# EAGLE design Dashboard rev3 (EAGLE 9.6.2)
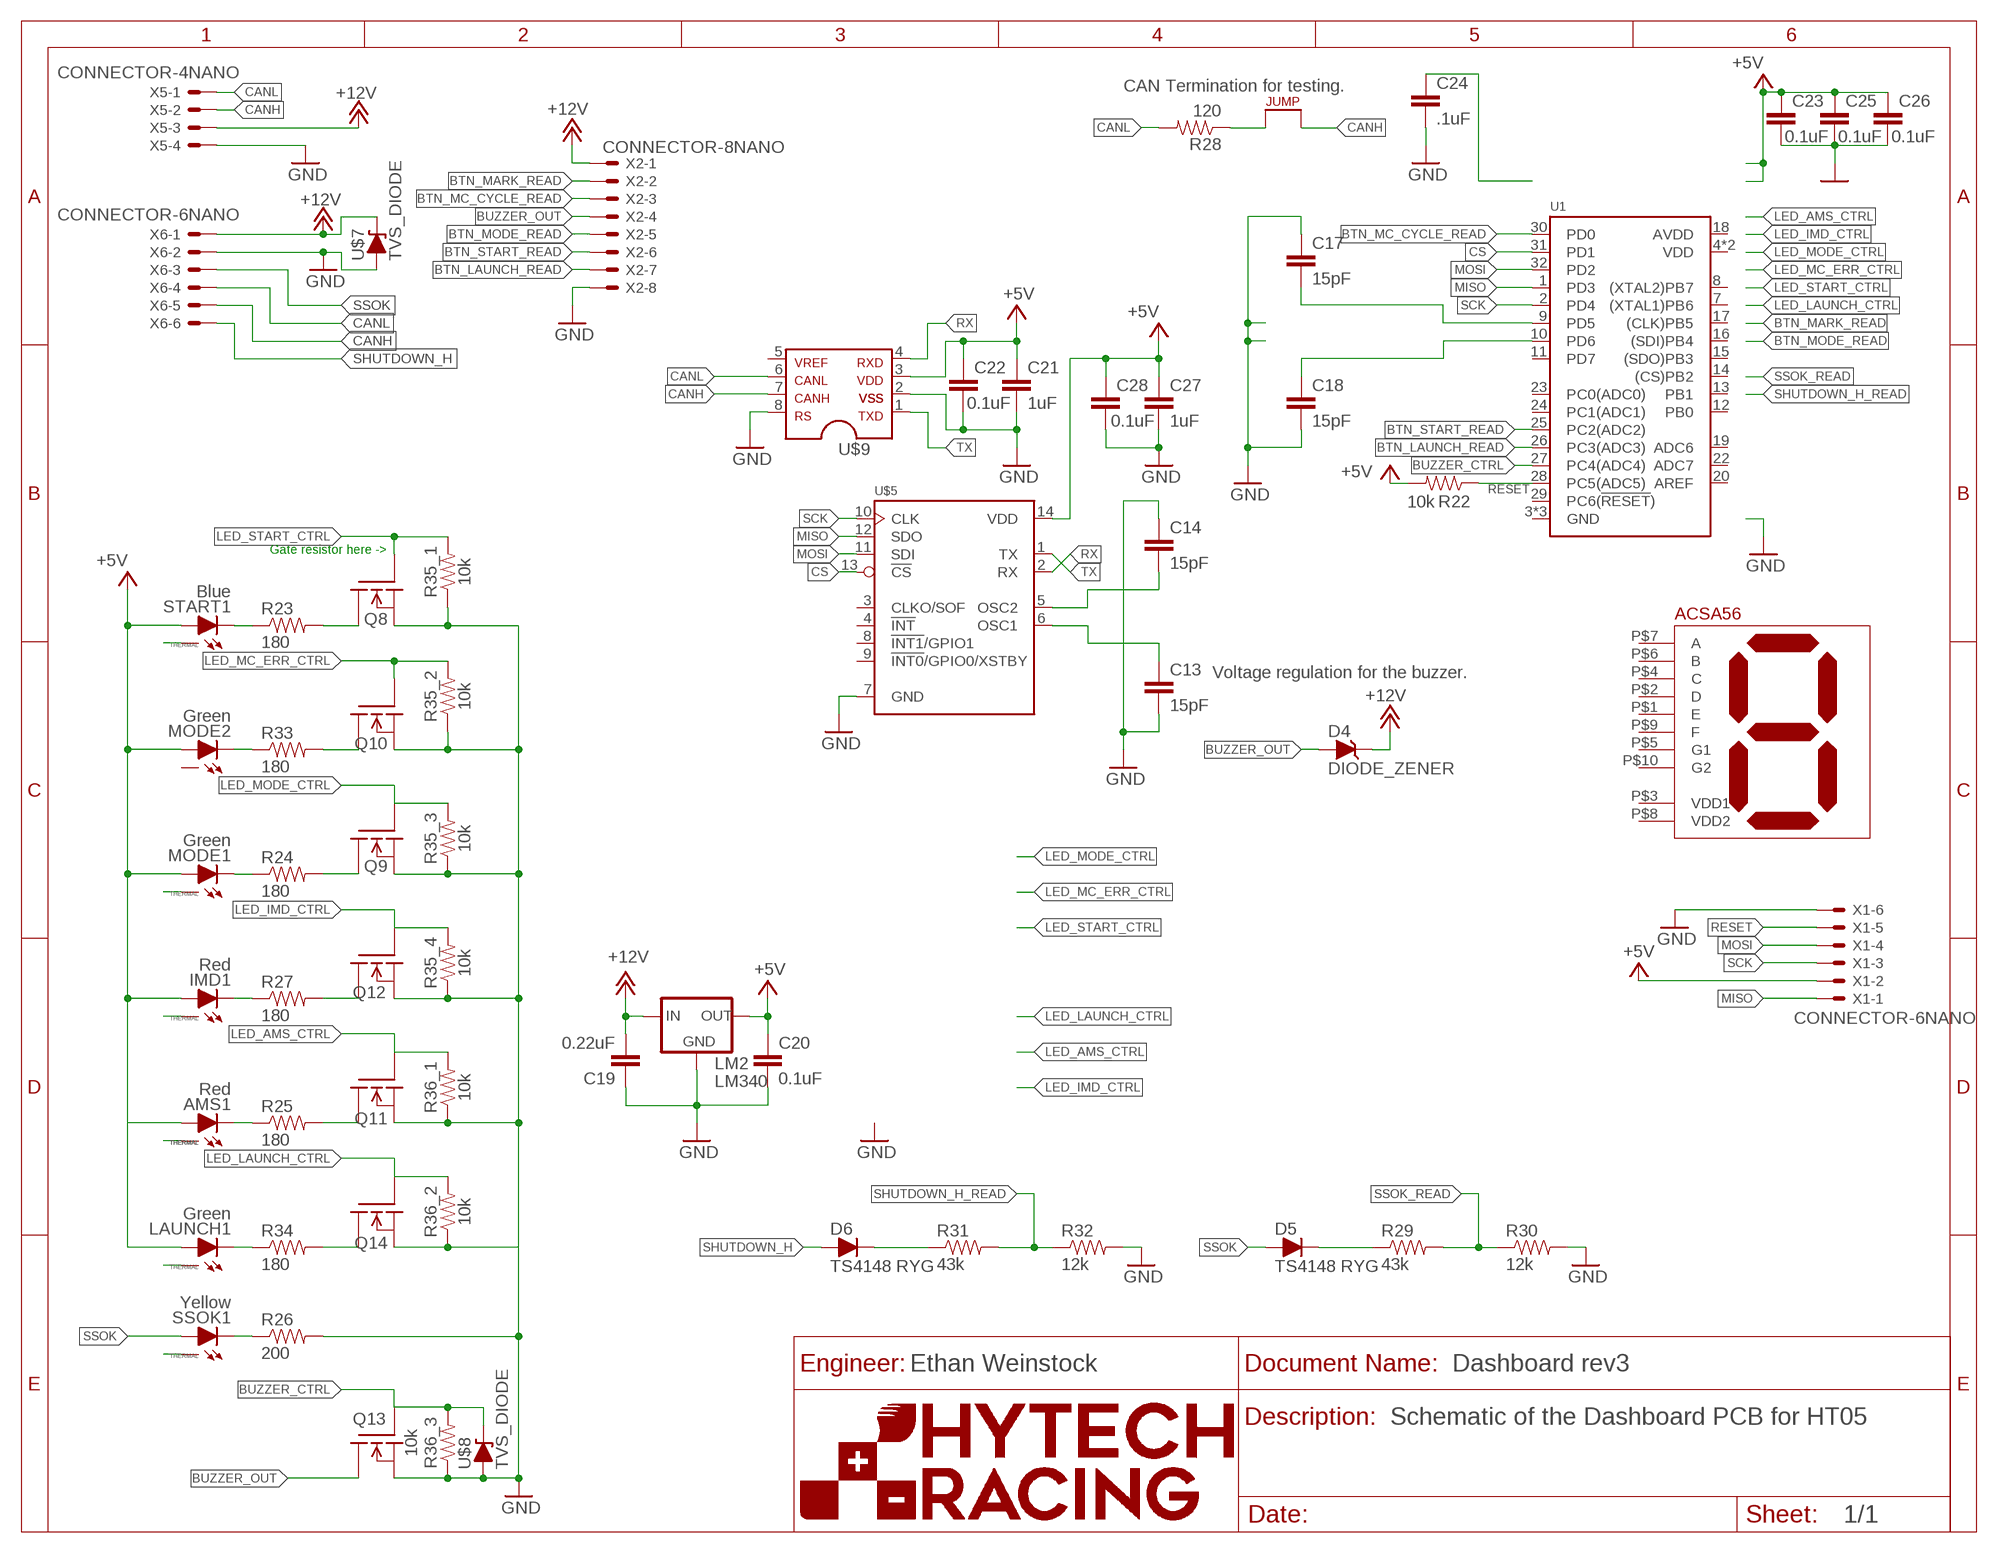
[diagram p0: schematic, sheet 1]
U$4 (FRAME_A_L): ORIENTATION: LANDSCAPE; SIZE: A

## Parts
AMS1  Red  XP-E2XP-E2  [XP-E2]
C13  15pF  CAP0603-CAP  [0603-CAP]
C14  15pF  CAP0603-CAP  [0603-CAP]
C17  15pF  CAP0603-CAP  [0603-CAP]
C18  15pF  CAP0603-CAP  [0603-CAP]
C19  0.22uF  CAP0603-CAP  [0603-CAP]
C20  0.1uF  CAP0603-CAP  [0603-CAP]
C21  1uF  CAP0603-CAP  [0603-CAP]
C22  0.1uF  CAP0603-CAP  [0603-CAP]
C23  0.1uF  CAP0603-CAP  [0603-CAP]
C24  .1uF  CAP0603-CAP  [0603-CAP]
C25  0.1uF  CAP0603-CAP  [0603-CAP]
C26  0.1uF  CAP0603-CAP  [0603-CAP]
C27  1uF  CAP0603-CAP  [0603-CAP]
C28  0.1uF  CAP0603-CAP  [0603-CAP]
D4  DIODE_ZENER  [SOT23]
D5  TS4148 RYG  DIODE0805  [0805_D]
D6  TS4148 RYG  DIODE0805  [0805_D]
IMD1  Red  XP-E2XP-E2  [XP-E2]
J4  JUMPER0603  [0603-JUMP]
LAUNCH1  Green  XP-E2XP-E2  [XP-E2]
LM2  LM340  [SOT223]
MODE1  Green  XP-E2XP-E2  [XP-E2]
MODE2  Green  XP-E2XP-E2  [XP-E2]
Q8  DMG3406LSOT  [SOT23]
Q9  DMG3406LSOT  [SOT23]
Q10  DMG3406LSOT  [SOT23]
Q11  DMG3406LSOT  [SOT23]
Q12  DMG3406LSOT  [SOT23]
Q13  DMG3406LSOT  [SOT23]
Q14  DMG3406LSOT  [SOT23]
R22  10k  RESISTOR0603  [0603-RES]
R23  180  RESISTOR0603  [0603-RES]
R24  180  RESISTOR0603  [0603-RES]
R25  180  RESISTOR0603  [0603-RES]
R26  200  RESISTOR0805-RES  [0805]
R27  180  RESISTOR0603  [0603-RES]
R28  120  RESISTOR0603-RES  [0603-RES]
R29  43k  RESISTOR0603  [0603-RES]
R30  12k  RESISTOR0603  [0603-RES]
R31  43k  RESISTOR0603  [0603-RES]
R32  12k  RESISTOR0603  [0603-RES]
R33  180  RESISTOR0603  [0603-RES]
R34  180  RESISTOR0603  [0603-RES]
R35  10k  CAT16-F4_1%  [CAT16-*4]
R36  10k  CAT16-F4_1%  [CAT16-*4]
SSOK1  Yellow  XP-E2XP-E2  [XP-E2]
START1  Blue  XP-E2XP-E2  [XP-E2]
U1  ATMEGA328P-AU  [TQFP-32]
U$1  ACSA56-51CGKWA  [ACSA56-51CGKWA]
U$5  MCP2518FD  [SOIC-14]
U$7  TVS_DIODE  [U-DFN1608-2]
U$8  TVS_DIODE  [U-DFN1608-2]
U$9  MCP2562FD  [SOIC-08]
X1  CONNECTOR-6NANO  [MOLEX_NANOFIT_SMD_06]
X2  CONNECTOR-8NANO  [MOLEX_NANOFIT_SMD_08]
X5  CONNECTOR-4NANO  [MOLEX_NANOFIT_SMD_04]
X6  CONNECTOR-6NANO  [MOLEX_NANOFIT_SMD_06]

## Nets
+5V: C20.1 C21.1 C22.1 C23.1 C25.1 C26.1 C27.1 C28.1 LM2.3(OUT) R22.2 U$5.14(VDD) U$9.3 X1.2
+5V1: AMS1.A IMD1.A LAUNCH1.A MODE1.A MODE2.A START1.A ; supply symbol labelled +5V
+12V: C19.2 D4.3(C) LM2.1(IN) U$7.P$2(C) X2.1 X5.3 X6.1
BTN_LAUNCH_READ: U1.26(PC3(ADC3)) X2.7
BTN_MARK_READ: X2.2
BTN_MC_CYCLE_READ: U1.30(PD0) X2.3
BTN_MODE_READ: X2.5
BTN_START_READ: U1.25(PC2(ADC2)) X2.6
BUZZER_CTRL: Q13.1(G) R36.P$6 U1.27(PC4(ADC4)) U$8.P$2(C)
BUZZER_OUT: D4.1(A) Q13.3(D) X2.4
CANH: J4.2 U$9.7 X5.2 X6.5
CANL: R28.2 U$9.6 X5.1 X6.4
CS: U1.31(PD1) U$5.13(!CS)
GND: C13.2 C14.1 C17.1 C18.2 C19.1 C20.2 C23.2 C24.2 C25.2 C26.2 C27.2 C28.2 LM2.2(GND) LM2.4(GND) Q8.2(S) Q9.2(S) Q10.2(S) Q11.2(S) Q12.2(S) Q13.2(S) R26.2 R30.2 R32.2 R35.P$1 R35.P$2 R35.P$3 R35.P$4 R36.P$1 R36.P$3 U$5.7(GND) U$7.P$1(A) U$8.P$1(A) U$9.8 X1.6 X2.8 X5.4 X6.2
GND2: Q14.2(S) R36.P$2
LED_AMS_CTRL: Q11.1(G) R36.P$8
LED_IMD_CTRL: Q12.1(G) R35.P$5
LED_LAUNCH_CTRL: Q14.1(G) R36.P$7
LED_MC_ERR_CTRL: Q10.1(G) R35.P$7
LED_MODE_CTRL: Q9.1(G) R35.P$6
LED_START_CTRL: Q8.1(G) R35.P$8
MISO: U1.1(PD3) U$5.12(SDO) X1.1
MOSI: U1.32(PD2) U$5.11(SDI) X1.4
N$1: C13.1 U$5.6(OSC1)
N$2: MODE2.C R33.1
N$3: C17.2 U1.9(PD5)
N$23: C18.1 U1.10(PD6)
N$24: MODE1.C R24.1
N$25: IMD1.C R27.1
N$26: R26.1 SSOK1.C
N$27: AMS1.C R25.1
N$29: C24.1
N$31: R23.1 START1.C
N$32: D5.C R29.1
N$33: D6.C R31.1
N$34: Q8.3(D) R23.2
N$35: Q10.3(D) R33.2
N$36: Q9.3(D) R24.2
N$37: Q12.3(D) R27.2
N$38: Q11.3(D) R25.2
N$39: J4.1 R28.1
N$40: LAUNCH1.C R34.1
N$41: Q14.3(D) R34.2
N$42: C14.2 C21.2 C22.2 U$5.5(OSC2) U$9.2 ; supply symbol labelled GND
RESET: R22.1 U1.28(PC5(ADC5)) X1.5
RX: U$5.2(RX) U$9.4
SCK: U1.2(PD4) U$5.10(CLK) X1.3
SHUTDOWN_H: D6.A X6.6
SHUTDOWN_H_READ: R31.2 R32.1
SSOK: D5.A SSOK1.A X6.3
SSOK_READ: R29.2 R30.1
THERMAL: AMS1.X IMD1.X LAUNCH1.X MODE1.X SSOK1.X START1.X
TX: U$5.1(TX) U$9.1
Unconnected: MODE2.X R36.P$4 R36.P$5 U1.7((XTAL1)PB6) U1.8((XTAL2)PB7) U1.11(PD7) U1.12(PB0) U1.13(PB1) U1.14((CS)PB2) U1.15((SDO)PB3) U1.16((SDI)PB4) U1.17((CLK)PB5) U1.19(ADC6) U1.20(AREF) U1.22(ADC7) U1.23(PC0(ADC0)) U1.24(PC1(ADC1)) U1.29(PC6(!RESET!)) U$1.P$1(E) U$1.P$2(D) U$1.P$3(VDD1) U$1.P$4(C) U$1.P$5(G1) U$1.P$6(B) U$1.P$7(A) U$1.P$8(VDD2) U$1.P$9(F) U$1.P$10(G2) U$5.3(CLKO/SOF) U$5.4(!INT) U$5.8(!INT1!/GPIO1) U$5.9(!INT0!/GPIO0/XSTBY) U$9.5

## Notes on the sheet
- CAN Termination for testing.
- Gate resistor here ->
- Voltage regulation for the buzzer.
- Ethan Weinstock
- Schematic of the Dashboard PCB for HT05

## Power pins joined to a net without a drawn wire
AVDD: U1.18(AVDD)
GND: U1.3(GND) U1.5(GND) U1.21(GND)
VDD: U1.4(VDD) U1.6(VDD)

## Library data of the parts
AMS1 IMD1 LAUNCH1 MODE1 MODE2 SSOK1 START1 = HyTechDevices:XP-E2: XP-E2 high-brightness LED. Data sheet <https://www.cree.com/led-components/media/documents/XLampXPE2.pdf>
C13 C14 C17-C28 = HyTechDevices:CAP: Capacitor Standard 0603 ceramic capacitor, and 0.1" leaded capacitor.
D4 = HyTechDevices:DIODE_ZENER: ZENER DIODE
D5 D6 = HyTechDevices:DIODE: DIODE general purpose rectifier
J4 = HyTechDevices:JUMPER: Jumper for changing operation of a device
LM2 = HyTechDevices:LM340: LM340 7.5-35V to 5V SMD regulator Mouser link <https://www.mouser.com/ProductDetail/Texas-Instruments/LM340MPX-50-NOPB?qs=sGAEpiMZZMvu8NZDyZ4K0cQiG3JqdhEW>
Q8-Q14 = HyTechDevices:DMG3406L: Generic NPN MOSFET DMG3406L (SOT-23, 2.8 A 30V)
R22-R34 = HyTechDevices:RESISTOR: Resistor Basic schematic elements and footprints for 0603, 1206, and PTH resistors.
R35 R36 = HyTechDevices:CAT16-*4: Bourns CAT16 series 4x 1% or 5% resistor array size 1206 Datasheet <https://www.bourns.com/docs/Product-Datasheets/CATCAY.pdf> Options: CAT16-F4: 1% tolerance CAT16-J4: 5% tolerance Alternatives: CTS Resistor Products 742C083 series - Datasheet <https://www.ctscorp.com/wp-content/uploads/74x.pdf> Panasonic EXBV8 series - Datasheet <https://industrial.panasonic.com/cdbs/www-data/pdf/AOC0000/AOC0000C14.pdf> Yageo TC164 series - Datasheet <https://www.yageo.com/upload/media/product/productsearch/datasheet/rchip/PYu-YC_TC_group_51_RoHS_L_9.pdf> Replaced by Yageo YC248
U1 = HyTechDevices - Copy:ATMEGA328P-AU: ATmega Series 20 MHz 32 KB Flash 2 KB SRAM 8-Bit Microcontroller - TQFP-32; AVAILABILITY: Unavailable; DESCRIPTION: AVR AVR® ATmega Microcontroller IC 8-Bit 20MHz 32KB _16K x 16_ FLASH 32-TQFP _7x7_; MF: Microchip; MP: ATMEGA328P-AU; PACKAGE: TQFP-32 Microchip; PRICE: None
U$1 = HyTechDevices:ACSA56-51CGKWA: Green, Low-Profile 7-Segment Display ACSA56-51CGKWA Datasheet <https://www.kingbrightusa.com/images/catalog/SPEC/ACSA56-51CGKWA.pdf>
U$5 = HyTechDevices:MCP2518FD: MCP2518FD Can Controller Datasheet <https://www.mouser.com/datasheet/2/268/External_CAN_FD_Controller_with_SPI_Interface_DS20-1947957.pdf>; DKPN: MCP2518FDT-E/SLCT-ND; MANUFACTURER: Microchip Technology; MOPN: 579-MCP2518FDT-E/SL; MPN: MCP2518FDT-E/SL
U$7 U$8 = HyTechDevices:TVS_DIODE
U$9 = HyTechDevices:MCP2562FD: MCP2562FD High-Speed CAN Transceiver Product Webpage <https://www.microchip.com/wwwproducts/en/MCP2562FD> Datasheet <https://ww1.microchip.com/downloads/en/DeviceDoc/20005284A.pdf>
X1 X6 = HyTechDevices:CONNECTOR-6: Mini-Fit Junior connector 6 pole Source: http://www.molex.com
X2 = HyTechDevices:CONNECTOR-8: Mini-Fit Junior connector 8 pole Source: http://www.molex.com
X5 = HyTechDevices:CONNECTOR-4: Mini-Fit Junior connector 4 pole Source: http://www.molex.com

## Board
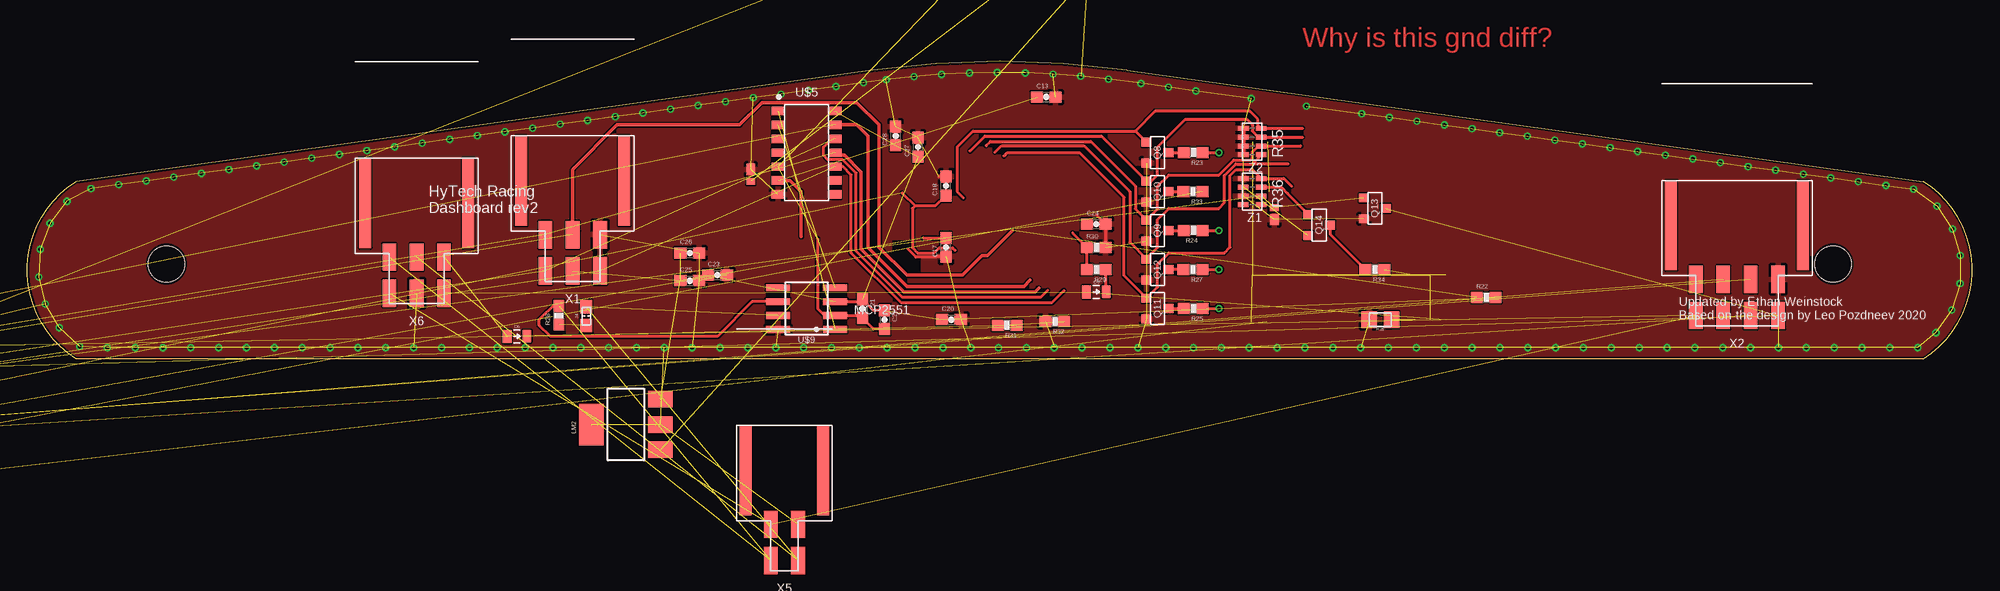
[diagram p1: board, top side]
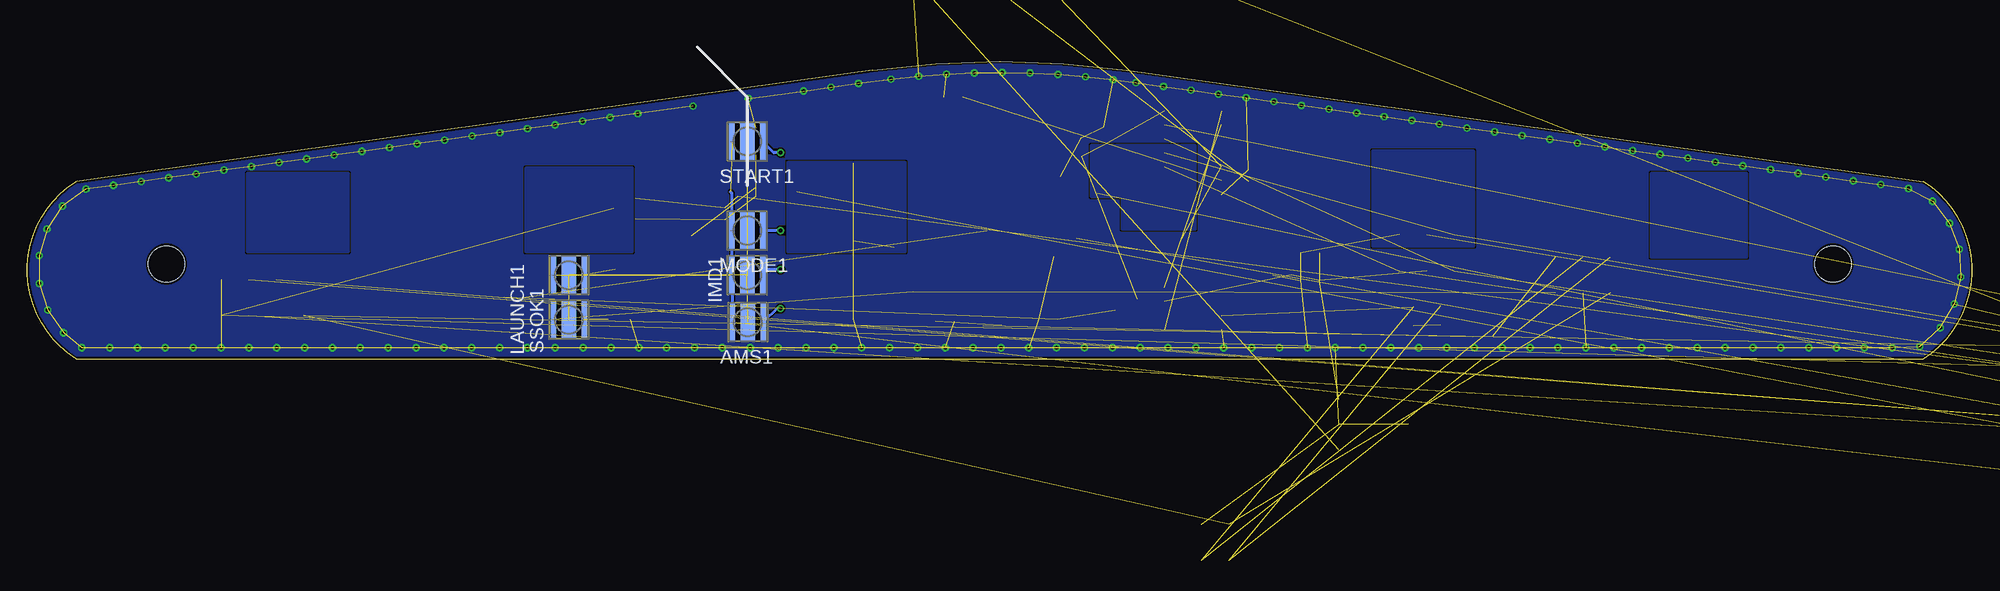
[diagram p2: board, bottom side, seen from below]

Size 177.34 x 27.14 mm. Coordinates in mm from the lower left corner, seen from the top.
Outline: 100.26,26.32 arc16 77.08,26.32 4.45,16.19 arc115 4.45,0 172.89,0 arc115 172.89,16.19 100.26,26.32
Copper layers (1*16): Top 0.035mm / dielectric 1.53mm / Bottom 0.035mm
Design rules "JLCPCB (2 Layer)": minimum track width 5mil, minimum drill 0.3mm, track to track 5mil, track to pad 5mil, pad to pad 5mil, via to via 20mil, smd to smd 5mil, copper to edge 0.2mm, drill to drill 21mil, minimum pad ring 6mil, minimum via ring 6mil, stop-mask expansion 6mil, vias tented up to drill 30mil, thermal gap 10mil
Holes 3.3 mm at 12.69,8.65 164.66,8.65

### Footprints (pad centres in the part's own frame; a part is rotated, then mirrored left to right if it is on the bottom)
XP-E2 = smd 0.5 x 3.3: A -1.4,0; C 1.4,0 | smd 1.3 x 3.3: X 0,0
0603-CAP = smd 1.1 x 1: 1 -0.85,0; 2 0.85,0
SOT23 = smd 0.8 x 0.9: 1 -0.95,-1; 2 0.95,-1; 3 0,1
0805_D = smd 0.8 x 1.2: A -0.9,0; C 0.9,0
0603-JUMP = smd 1.2 x 1.1: 1 -0.85,0; 2 0.85,0
SOT223 = smd 1.5 x 2.235: 1 -2.3,-3.15; 2 0,-3.15; 3 2.3,-3.15 | smd 3.8 x 2.2: 4 0,3.15
0603-RES = smd 1.1 x 1: 1 -0.85,0; 2 0.85,0
0805 = smd 1.4 x 1.5: 1 -1.025,0; 2 1.025,0
CAT16-*4 = smd 0.45 x 0.95: P$1 -1.2,-0.825; P$2 -0.4,-0.825; P$3 0.4,-0.825; P$4 1.2,-0.825; P$5 1.2,0.825; P$6 0.4,0.825; P$7 -0.4,0.825; P$8 -1.2,0.825
TQFP-32 = smd 1.55 x 0.55: 1 -4.2,2.8; 2 -4.2,2; 3 -4.2,1.2; 4 -4.2,0.4; 5 -4.2,-0.4; 6 -4.2,-1.2; 7 -4.2,-2; 8 -4.2,-2.8; 17 4.2,-2.8; 18 4.2,-2; 19 4.2,-1.2; 20 4.2,-0.4; 21 4.2,0.4; 22 4.2,1.2; 23 4.2,2; 24 4.2,2.8 | smd 0.55 x 1.55: 9 -2.8,-4.2; 10 -2,-4.2; 11 -1.2,-4.2; 12 -0.4,-4.2; 13 0.4,-4.2; 14 1.2,-4.2; 15 2,-4.2; 16 2.8,-4.2; 25 2.8,4.2; 26 2,4.2; 27 1.2,4.2; 28 0.4,4.2; 29 -0.4,4.2; 30 -1.2,4.2; 31 -2,4.2; 32 -2.8,4.2
ACSA56-51CGKWA = smd 1.9 x 3: P$1 -5.08,-10; P$2 -2.54,-10; P$3 0,-10; P$4 2.54,-10; P$5 5.08,-10; P$6 5.08,10; P$7 2.54,10; P$8 0,10; P$9 -2.54,10; P$10 -5.08,10
SOIC-14 = smd 0.762 x 1.143: 1 -3.81,-2.603; 2 -2.54,-2.603; 3 -1.27,-2.603; 4 0,-2.603; 5 1.27,-2.603; 6 2.54,-2.603; 7 3.81,-2.603; 8 3.81,2.603; 9 2.54,2.603; 10 1.27,2.603; 11 0,2.603; 12 -1.27,2.603; 13 -2.54,2.603; 14 -3.81,2.603
U-DFN1608-2 = smd 0.8 x 1.011: P$1 0,0 | smd 0.8 x 0.61: P$2 0,-1.092
SOIC-08 = smd 0.6 x 2.2: 1 -1.905,-2.6; 2 -0.635,-2.6; 3 0.635,-2.6; 4 1.905,-2.6; 5 1.905,2.6; 6 0.635,2.6; 7 -0.635,2.6; 8 -1.905,2.6
MOLEX_NANOFIT_SMD_06 = smd 1.24 x 2.5: 1 2.5,1.65; 2 0,1.65; 3 -2.5,1.65; 4 2.5,-1.65; 5 0,-1.65; 6 -2.5,-1.65 | smd 1.1 x 8.2: PAD -4.7,-6.58; PAD@2 4.7,-6.58
MOLEX_NANOFIT_SMD_08 = smd 1.24 x 2.5: 1 3.75,1.65; 2 1.25,1.65; 3 -1.25,1.65; 4 -3.75,1.65; 5 3.75,-1.65; 6 1.25,-1.65; 7 -1.25,-1.65; 8 -3.75,-1.65 | smd 1.1 x 8.2: PAD -6.02,-6.58; PAD@1 6.02,-6.58
MOLEX_NANOFIT_SMD_04 = smd 1.24 x 2.5: 1 1.25,1.65; 2 -1.25,1.65; 3 1.25,-1.65; 4 -1.25,-1.65 | smd 1.1 x 8.2: PAD1 -3.52,-6.58; PAD@1 3.52,-6.58

### Placement (x,y rotation side)
AMS1  111.63,3.34 0 bottom
C13  92.9,23.89 0 top
C14  98.49,49.8 0 top  (outside the outline)
C17  83.76,10.17 90 top
C18  83.76,15.76 90 top
C19  109.16,49.8 0 top  (outside the outline)
C20  84.26,3.57 0 top
C21  76.14,4.58 270 top
C22  78.17,3.57 270 top
C23  62.93,7.63 0 top
C24  97.47,12.28 0 top
C25  60.39,7.12 0 top
C26  60.39,9.66 0 top
C27  81.22,19.32 90 top
C28  79.18,20.33 90 top
D4  -13.18,0.04 0 top  (outside the outline)
D5  97.47,6.11 0 top
D6  44.64,2.04 0 top
IMD1  111.7,7.63 0 bottom
J4  50.97,3.9 90 top
LAUNCH1  127.95,7.63 0 bottom
LM2  54.57,-5.99 90 top  (outside the outline)
MODE1  111.7,11.7 0 bottom
MODE2  -63.06,-17.26 0 top  (outside the outline)
Q8  103.06,18.81 270 top
Q9  103.06,11.7 270 top
Q10  103.06,15.25 270 top
Q11  103.06,4.58 270 top
Q12  103.06,8.14 270 top
Q13  122.87,13.73 270 top
Q14  117.79,12.2 270 top
R22  133.03,5.6 0 top
R23  106.31,18.82 180 top
R24  106.31,11.72 180 top
R25  106.31,4.58 180 top
R26  123.38,3.57 180 top
R27  106.29,8.14 180 top
R28  48.46,3.96 90 top
R29  97.47,8.14 180 top
R30  97.47,10.17 0 top
R31  89.34,3.06 180 top
R32  93.69,3.4 180 top
R33  106.29,15.25 180 top
R34  122.87,8.14 180 top
R35  111.7,19.82 270 top
R36  111.7,15.25 270 top
SSOK1  127.95,3.57 0 bottom
START1  111.7,19.82 0 bottom
U1  -86.93,-15.74 0 top  (outside the outline)
U$1  -72.71,-9.64 0 top  (outside the outline)
U$5  71.06,18.81 270 top
U$7  65.98,17.28 0 top
U$8  113.73,12.71 180 top
U$9  71.06,4.58 90 top
X1  49.72,9.66 180 top
X2  155.89,5.6 180 top
X5  69.02,-16.75 180 top  (outside the outline)
X6  35.5,7.63 180 top

### Tracks (layer width: path | path; a pad name or v marks a point on that pad's centre or on a via)
+5V  (10 unrouted)
  Top 0.254: C22.1 77.15,4.42 C21.1 75.92,5.22 U$9.3
+5V1  (3 unrouted)
  Bottom 0.254: AMS1.A 113.03,7.57 IMD1.A MODE1.A 113.1,15.13 113.22,15.25
+12V  (6 unrouted)
BTN_LAUNCH_READ  (1 unrouted)
BTN_MC_CYCLE_READ  (1 unrouted)
BTN_START_READ  (1 unrouted)
BUZZER_CTRL  (3 unrouted)
BUZZER_OUT  (2 unrouted)
CANH  (3 unrouted)
  Top 0.254: X5.2
CANL  (2 unrouted)
  Top 0.254: R28.2 48.47,5.09 48.2,5.09 46.67,3.57 46.67,3.06 47.69,2.04 62.93,2.04 66.1,5.22 U$9.6
CS  (1 unrouted)
  Top 0.305: 91.43,7.18 90.87,6.62 80.2,6.62 76.64,10.17 76.64,20.33 75.63,21.35 U$5.13
GND  (via drill 0.35)  (178 unrouted)
  Top 0.254: 102.11,10.75 Q9.2 | 97.52,13.09 C24.2 R30.2 | R35.P$1 R35.P$2 R35.P$3 R35.P$4 | C17.1 82.89,9.32 82.85,9.28 81.03,9.28 80.33,9.99 | C18.2 83.11,16.61
  other vias: 172.38,1.02 169.84,1.02 167.3,1.02 164.76,1.02 162.22,1.02 159.68,1.02 157.14,1.02 154.6,1.02 152.06,1.02 149.52,1.02 146.98,1.02 144.44,1.02 141.9,1.02 139.36,1.02 136.82,1.02 134.28,1.02 131.74,1.02 129.2,1.02 126.66,1.02 124.12,1.02 121.58,1.02 119.04,1.02 116.5,1.02 113.96,1.02 111.42,1.02 108.88,1.02 106.34,1.02 103.8,1.02 101.26,1.02 98.72,1.02 96.18,1.02 93.64,1.02 91.1,1.02 88.56,1.02 86.02,1.02 83.48,1.02 80.94,1.02 78.4,1.02 75.86,1.02 73.32,1.02 70.78,1.02 68.24,1.02 65.7,1.02 63.16,1.02 60.62,1.02 58.08,1.02 55.54,1.02 53,1.02 50.46,1.02 47.92,1.02 45.38,1.02 42.84,1.02 40.3,1.02 37.76,1.02 35.22,1.02 32.68,1.02 30.14,1.02 27.6,1.02 25.06,1.02 22.52,1.02 19.98,1.02 17.44,1.02 14.9,1.02 12.36,1.02 9.82,1.02 7.28,1.02 4.78,1.13 2.9,2.84 1.61,5.01 1.02,7.47 1.17,10 2.06,12.37 3.61,14.37 76.26,25.19 73.74,24.85 71.23,24.5 68.71,24.16 66.19,23.81 63.68,23.47 61.16,23.13 58.65,22.78 56.13,22.44 53.61,22.09 51.1,21.75 48.58,21.4 46.06,21.06 43.55,20.71 41.03,20.37 38.51,20.02 36,19.68 33.48,19.33 30.96,18.99 28.45,18.64 25.93,18.3 23.41,17.96 20.9,17.61 18.38,17.27 15.86,16.92 13.35,16.58 10.83,16.23 8.31,15.89 5.8,15.54 98.58,25.52 96.06,25.79 93.52,25.98 90.99,26.09 88.45,26.12 85.91,26.08 83.37,25.95 80.84,25.75 78.31,25.47 101.54,25.13 104.06,24.78 106.57,24.44 111.61,23.75 116.64,23.06 121.67,22.37 124.19,22.03 126.7,21.68 129.22,21.34 131.74,20.99 134.25,20.65 136.77,20.3 139.29,19.96 141.8,19.62 144.32,19.27 146.84,18.93 149.35,18.58 151.87,18.24 154.39,17.89 156.9,17.55 159.42,17.2 161.94,16.86 164.45,16.51 166.97,16.17 169.48,15.82 172,15.48 174.04,2.39 175.48,4.47 176.24,6.88 176.27,9.41 175.55,11.84 174.14,13.94
  pour Bottom (rank 2): -5.14,27.95 -5.14,-3.54 179.26,-3.54 179.26,24.9 179.26,27.95
  pour Top: -5.14,27.95 -5.14,-3.54 179.26,-3.54 179.26,27.95
  cutout Top: 78.91,10.74 78.91,8.69 79.9,7.7 80.18,7.7 80.23,7.75 80.54,7.75 80.58,7.71 80.67,7.71 80.81,7.57 80.91,7.57 81,7.48 81.29,7.48 81.46,7.65 81.46,9.65 80.37,10.74
GND2  (1 unrouted)
LED_AMS_CTRL
  Top 0.254: 89.03,18.5 89.34,18.81 95.95,18.81 100.01,14.74 100.01,7.58 Q11.1 103.06,6.53 103.06,8.65 104.08,9.66 109.16,9.66 109.68,10.19 109.68,16.72 110.21,17.25 111.73,17.25 R36.P$8 114.56,16.45 115.28,15.74
LED_IMD_CTRL
  Top 0.254: 88.23,18.84 88.84,19.44 96.33,19.44 100.52,15.25 100.52,10.63 Q12.1 102.06,9.17 103.06,10.17 103.06,12.71 104.08,13.73 108.65,13.73 109.16,14.24 109.16,16.73 110.19,17.76 111.7,17.76 111.71,17.78 | R35.P$5 112.52,18.59 111.71,17.78 | 114.97,17.78 111.71,17.78
LED_LAUNCH_CTRL
  Top 0.254: R36.P$7 114.34,15.65 114.91,15.09 116.79,13.2 Q14.1
LED_MC_ERR_CTRL
  Top 0.254: 85.93,18.95 87.31,20.33 97.93,20.33 Q10.1 102.49,16.2 103.06,16.78 103.06,19.32 105.6,21.86 111.19,21.86 111.7,21.35 111.7,20.79 112.26,20.22 R35.P$7 116.27,20.22
LED_MODE_CTRL
  Top 0.254: 87.43,19.44 87.82,19.82 96.96,19.82 101.03,15.76 101.03,13.68 Q9.1 103.06,13.65 103.06,15.76 104.08,16.78 108.65,16.78 110.02,18.15 111.54,18.15 111.7,18.3 111.7,18.86 112.26,19.42 R35.P$6 116.12,19.42
LED_START_CTRL
  Top 0.254: 85.35,14.69 84.77,15.26 84.77,19.32 86.23,20.77 101.03,20.77 | 101.03,20.77 101.04,20.77 Q8.1 | 101.03,20.77 102.83,22.58 111.48,22.58 112.2,21.86 112.2,21.34 R35.P$8 116.29,21.02
MISO  (2 unrouted)
  Top 0.254: U$5.12 73.34,20.08 72.58,19.32 72.58,18.58 72.98,18.17 74.34,18.17 75.56,16.95 75.56,9.82 79.78,5.6 92.39,5.6 93.03,6.24
MOSI  (2 unrouted)
  Top 0.305: 92.23,6.46 91.88,6.11 79.92,6.11 76.03,9.99 76.03,17.05 74.51,18.58 73.89,18.58 U$5.11
N$1  (1 unrouted)
  Top 0.305: U$5.6 69.53,16.27 70.55,15.25 70.55,11.14
N$2  (1 unrouted)
N$3  (1 unrouted)
  Top 0.254: 81.69,11.02 C17.2 84.09,10.69
N$23  (1 unrouted)
  Top 0.254: 79.78,15.14 80.93,13.98 | C18.1 82.83,13.98 80.93,13.98 | 80.93,13.98 80.93,13.95 80.71,13.73 80.71,10.14 81.19,9.66 82.69,9.66 83.15,10.13 84.36,10.13 84.6,9.89
N$24  (via drill 0.35)
  Top 0.254: R24.1 108.62,11.72 v108.65,11.7
  Bottom 0.254: v108.65,11.7 MODE1.C
N$25  (via drill 0.35)
  Top 0.254: R27.1 v108.65,8.14
  Bottom 0.254: v108.65,8.14 109.79,8.14 IMD1.C
N$26  (1 unrouted)
N$27  (via drill 0.35)
  Top 0.254: R25.1 v108.65,4.58
  Bottom 0.254: v108.65,4.58 108.99,4.58 AMS1.C
N$29
  Top 0.254: C24.1
N$31  (via drill 0.35)
  Top 0.254: R23.1 108.64,18.82 v108.65,18.81
  Bottom 0.254: v108.65,18.81 109.28,18.81 START1.C
N$32
  Top 0.254: D5.C 98.37,8.09 R29.1
N$33  (1 unrouted)
N$34
  Top 0.254: Q8.3 104.07,18.82 R23.2
N$35
  Top 0.254: Q10.3 R33.2
N$36
  Top 0.254: Q9.3 104.09,11.72 R24.2
N$37
  Top 0.254: R27.2 Q12.3
N$38
  Top 0.254: Q11.3 R25.2
N$39  (1 unrouted)
N$40  (1 unrouted)
N$41
  Top 0.254: Q14.3 118.79,11.37 R34.2
N$42  (2 unrouted)
  Top 0.254: C22.2 77.15,2.72 C21.2 75.92,3.95 U$9.2 72.71,3.95 72.07,4.58 72.07,9 72.05,9.03 72.05,10.96
RESET  (2 unrouted)
  Top 0.305: 50.23,11.7 50.1,11.7 X1.5 49.72,17.28 53.78,21.35 64.96,21.35 66.99,23.38 75.63,23.38 77.66,21.35 77.66,10.17 80.2,7.63 85.28,7.63 86.88,9.23 86.88,9.25 87.04,9.42 87.53,9.42 89.83,11.72 89.85,11.7
RX  (1 unrouted)
SCK  (2 unrouted)
  Top 0.254: 94.53,6.22 93.41,5.09 79.69,5.09 75.12,9.66 75.12,16.78 74.36,17.54 U$5.10
SHUTDOWN_H  (1 unrouted)
SHUTDOWN_H_READ  (1 unrouted)
SSOK  (2 unrouted)
SSOK_READ
  Top 0.254: 95.31,11.49 R30.1 R29.2
THERMAL  (5 unrouted)
  pour Bottom: 20.6,16.9 29.23,16.9 29.23,9.28 20.6,9.28
  pour Bottom: 45.49,18.93 54.63,18.93 54.63,10.3 45.49,10.3
  pour Bottom: 70.89,19.44 80.29,19.44 80.29,14.78 77.48,14.78 77.49,14.77 77.49,11.82 70.89,11.82
  pour Bottom: 97.31,17.92 107.97,17.92 107.97,9.79 97.31,9.79
  pour Bottom: 122.2,17.41 131.85,17.41 131.85,9.79 122.2,9.79
THERMAL5
  pour Bottom: 148.11,16.9 157.25,16.9 157.25,9.79 148.11,9.79
TX  (1 unrouted)
VDD  (1 unrouted)

### Text on the board
Top: Why is this gnd diff?
tNames: Z2 | HyTech Racing / Dashboard rev2 | Z1 | MCP2551 | Updated by Ethan Weinstock / Based on the design by Leo Pozdneev 2020